# EAGLE design teensy_rfm69cw_nrf_upper (EAGLE 6.5.0)
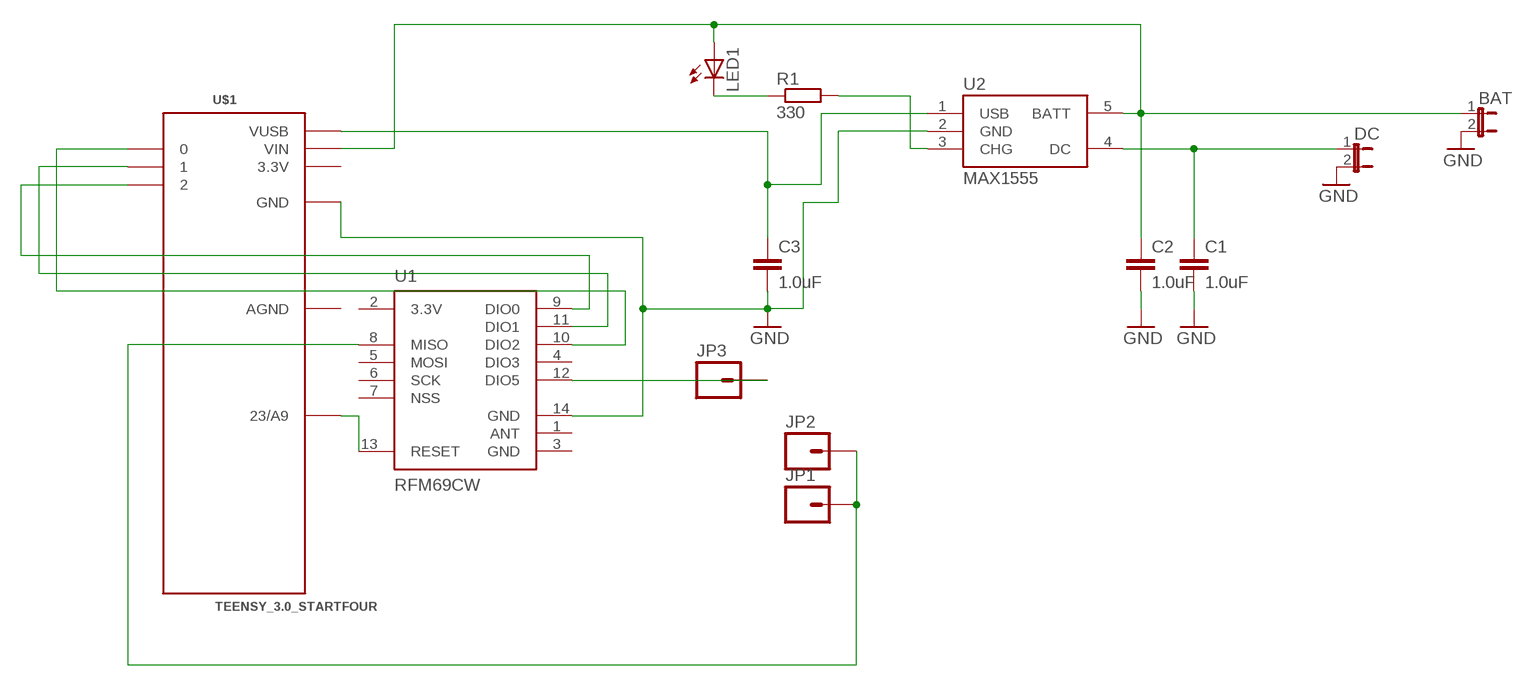
[diagram p0: schematic, sheet 1]

## Parts
BAT  JP1E  [JP1]
C1  1.0uF  1.0UF-16V-10%(0603)  [0603-CAP]
C2  1.0uF  1.0UF-16V-10%(0603)  [0603-CAP]
C3  1.0uF  1.0UF-16V-10%(0603)  [0603-CAP]
DC  JP1E  [JP1]
JP1  M01SMD-4.5X1.5  [PAD-1.5X4.5]
JP2  M01SMD-4.5X1.5  [PAD-1.5X4.5]
JP3  M01SMD-4.5X1.5  [PAD-1.5X4.5]
LED1  LEDSML0603  [SML0603]
R1  330  R-EU_R0603  [R0603]
U1  RFM69CW  [RFM69CW-XXXS2]
U2  MAX1555  [SOT23-5]
U$1  TEENSY_3.0_STARTFOUR  [TEENSY_3.0_STARTFOUR]

## Nets
GND: BAT.2 C1.2 C2.2 C3.2 DC.2 U1.14(GND) U2.2(GND) U$1.GND
N$1: LED1.C R1.1
N$2: U1.9(DIO0) U$1.2
N$3: U1.11(DIO1) U$1.1
N$4: U1.10(DIO2) U$1.0
N$5: U1.13(RESET) U$1.23/A9
N$6: C1.1 DC.1 U2.4(DC)
N$7: C3.1 U2.1(USB) U$1.VUSB
N$8: R1.2 U2.3(CHG)
N$9: JP1.P$1 JP2.P$1 U1.8(MISO)
N$10: BAT.1 C2.1 LED1.A U2.5(BATT) U$1.VIN
N$11: JP3.P$1 U1.12(DIO5)
Unconnected: U1.1(ANT) U1.4(DIO3) U1.5(MOSI) U1.6(SCK) U1.7(NSS)

## Power pins joined to a net without a drawn wire
3.3V: U1.2(3.3V) U$1.3.3V
AGND: U$1.AGND
GND: U1.3(GND)

## Library data of the parts
BAT DC = jumper:JP1E: JUMPER
C1-C3 = SparkFun-Capacitors:1.0UF-16V-10%(0603): CAP-00868; PROD_ID: CAP-00868
JP1-JP3 = mike-temp:M01: Header 1 Standard 1-pin 0.1" header. Use with straight break away headers (SKU : PRT-00116), right angle break away headers (PRT-00553), swiss pins (PRT-00743), machine pins (PRT-00117), and female headers (PRT-00115).
LED1 = led:LED: LED OSRAM: - CHIPLED LG R971, LG N971, LY N971, LG Q971, LY Q971, LO R971, LY R971 LH N974, LH R974 LS Q976, LO Q976, LY Q976 LO Q996 - Hyper CHIPLED LW Q18S LB Q993, LB Q99A, LB R99A - SideLED LS A670, LO A670, LY A670, LG A670, LP A670 LB A673, LV A673, LT A673, LW A673 LH A674 LY A675 LS A676, LA A676, LO A676, LY A676, LW A676 LS A679, LY A679, LG A679 - Hyper Micro SIDELED® LS Y876, LA Y876, LO Y876, LY Y876 LT Y87S - SmartLED LW L88C, LW L88S LB L89C, LB L89S, LG L890 LS L89K, LO L89K, LY L89K LS L896, LA L896, LO L896, LY L896 - TOPLED LS T670, LO T670, LY T670, LG T670, LP T670 LSG T670, LSP T670, LSY T670, LOP T670, LYG T670 LG T671, LOG T671, LSG T671 LB T673, LV T673, LT T673, LW T673 LH T674 LS T676, LA T676, LO T676, LY T676, LB T676, LH T676, LSB T676, LW T676 LB T67C, LV T67C, LT T67C, LS T67K, LO T67K, LY T67K, LW E67C LS E67B, LA E67B, LO E67B, LY E67B, LB E67C, LV E67C, LT E67C LW T67C LS T679, LY T679, LG T679 LS T770, LO T770, LY T770, LG T770, LP T770 LB T773, LV T773, LT T773, LW T773 LH T774 LS E675, LA E675, LY E675, LS T675 LS T776, LA T776, LO T776, LY T776, LB T776 LHGB T686 LT T68C, LB T68C - Hyper Mini TOPLED® LB M676 - Mini TOPLED Santana® LG M470 LS M47K, LO M47K, LY M47K Source: http://www.osram.convergy.de LUXEON: - LUMILED® LXK2-PW12-R00, LXK2-PW12-S00, LXK2-PW14-U00, LXK2-PW14-V00 LXK2-PM12-R00, LXK2-PM12-S00, LXK2-PM14-U00 LXK2-PE12-Q00, LXK2-PE12-R00, LXK2-PE12-S00, LXK2-PE14-T00, LXK2-PE14-U00 LXK2-PB12-K00, LXK2-PB12-L00, LXK2-PB12-M00, LXK2-PB14-N00, LXK2-PB14-P00, LXK2-PB14-Q00 LXK2-PR12-L00, LXK2-PR12-M00, LXK2-PR14-Q00, LXK2-PR14-R00 LXK2-PD12-Q00, LXK2-PD12-R00, LXK2-PD12-S00 LXK2-PH12-R00, LXK2-PH12-S00 LXK2-PL12-P00, LXK2-PL12-Q00, LXK2-PL12-R00 Source: www.luxeon.com KINGBRIGHT: KA-3528ASYC Source: www.kingbright.com
R1 = rcl:R-EU_: RESISTOR, European symbol
U1 = mike-temp:RFM69
U2 = SparkFun-PowerIC:MAX1555: MAX1555 Lithium Charger IC SOT-23 Lithium Polymer charging IC. Schematic element and footprint proven. Spark Fun Electronics SKU : COM-00674
U$1 = Teensy3.0:TEENSY_3.0_STARTFOUR

## Board
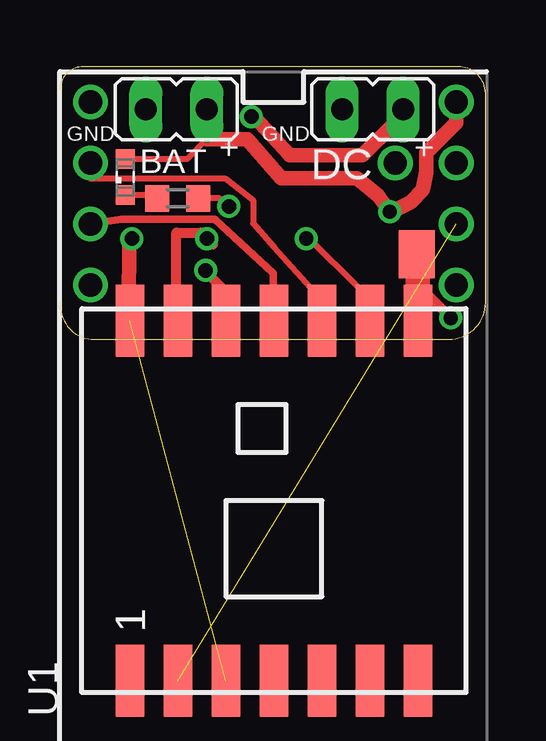
[diagram p1: board, top side]
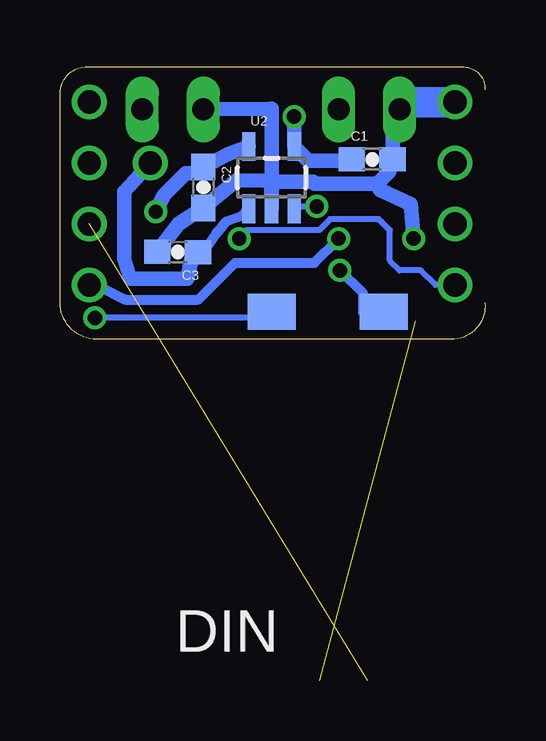
[diagram p2: board, bottom side, seen from below]

Size 17.71 x 11.34 mm. Coordinates in mm from the lower left corner, seen from the top.
Outline: 0.01,10.4 arc-90 0.87,11.34 16.67,11.34 arc-90 17.71,10.15 17.71,1.52 arc-90 16.19,0 1.28,0 arc-90 0.01,1.52
Copper layers (1*16): Top 0.0356mm / dielectric 1.5011mm / Bottom 0.0356mm
Design rules "LaenPCBOrder": minimum track width 6mil, minimum drill 13mil, track to track 6mil, track to pad 6mil, pad to pad 6mil, via to via 6mil, smd to smd 6mil, copper to edge 15mil, drill to drill 6mil, minimum pad ring 7mil, minimum via ring 7mil, stop-mask expansion 3mil, vias tented up to drill 0mil, thermal gap 10mil

### Footprints (pad centres in the part's own frame; a part is rotated, then mirrored left to right if it is on the bottom)
JP1 = drill 0.914 long: 1 0,-1.27; 2 0,1.27
0603-CAP = smd 1.1 x 1: 1 -0.85,0; 2 0.85,0
PAD-1.5X4.5 = smd 1.5 x 2: P$1 0,0
SML0603 = smd 0.8 x 0.8: A 0.75,0; C -0.75,0
R0603 = smd 1 x 1.1: 1 -0.85,0; 2 0.85,0
RFM69CW-XXXS2 = smd 3 x 1.2: 1 -7.5,6; 2 -7.5,4; 3 -7.5,2; 4 -7.5,0; 5 -7.5,-2; 6 -7.5,-4; 7 -7.5,-6; 8 7.5,-6; 9 7.5,-4; 10 7.5,-2; 11 7.5,0; 12 7.5,2; 13 7.5,4; 14 7.5,6
SOT23-5 = smd 0.55 x 1.2: 1 -0.95,-1.3; 2 0,-1.3; 3 0.95,-1.3; 4 0.95,1.3; 5 -0.95,1.3
TEENSY_3.0_STARTFOUR = drill 0.965: 0 -7.62,13.97; 1 -7.62,11.43; 2 -7.62,8.89; 3.3V 7.62,11.43; 23/A9 7.62,8.89; AGND 7.62,13.97; GND -7.62,16.51; VIN 7.62,16.51; VUSB 5.08,13.97

### Placement (x,y rotation side)
BAT  4.83,9.58 90 top
C1  4.7,7.49 0 bottom
C2  11.74,6.32 270 bottom
C3  12.81,3.63 179.7 bottom
DC  13.01,9.58 90 top
JP1  14.84,3.53 180 top
JP2  8.9,1.14 270 bottom
JP3  4.22,1.14 270 bottom
LED1  2.7,6.76 90 top
R1  4.88,5.87 0 top
U1  8.9,-6.73 90 top
U2  8.9,6.73 0 bottom
U$1  8.87,-6.63 0 top

### Tracks (layer width: path | path; a pad name or v marks a point on that pad's centre or on a via)
3.3V  (1 unrouted)
GND  (via drill 0.6 pad 0.3)  (1 unrouted)
  Top 0.61: U1.14 2.9,2.06 2.7,1.3 2.98,1.19 2.77,0.81 2.67,0.94 2.85,1.37 2.88,4.09 v2.98,4.19
  Bottom 0.61: BAT.2 3.85,9.36 C1.2 3.99,7.21 3.99,6.98 4.5,6.48 | DC.2 8.92,9.6 8.9,9.6 U2.2 8.92,6.55 | 8.92,6.55 8.92,6.6 10.34,6.63 C2.2 12.76,4.8 C3.2 | 4.5,6.48 7.09,6.48 7.17,6.55 8.62,6.55 8.92,6.55 | v2.98,4.19 3.1,5.61 4.35,6.2 4.37,6.2 4.5,6.48
  Bottom 1.27: U$1.GND 3.38,9.88 3.41,9.86 BAT.2
N$1
  Top 0.254: R1.1 3.89,6.01 LED1.C
N$2  (via drill 0.6)
  Top 0.152: v10.24,4.19 10.32,4.22 | 12.88,2.06 U1.9
  Top 0.254: 12.88,2.06 12.5,2.06 10.29,4.27 10.24,4.22 v10.24,4.19
  Bottom 0.254: v10.24,4.19 9.91,4.55 6.91,4.55 6.46,5 4.45,5 4.32,4.9 3.97,4.55 3.97,3.28 3.56,2.87 2.67,2.87 2.06,2.26 U$1.2
N$3
  Top 0.305: U$1.1 2.55,5 6.43,5 8.87,2.74 U1.11
N$4
  Top 0.254: U$1.0 1.25,6.71 6.86,6.71 8.03,5.79 8.03,4.83 8.9,3.86 10.8,1.73 10.9,1.63 U1.10
N$5  (via drill 0.6)
  Top 0.406: U1.13 4.83,2.16 4.83,4.45 5.85,4.45 v6.1,4.19 6.36,3.94
  Bottom 0.406: U$1.23/A9 16.26,2.16 16.01,2.16 14.99,1.65 11.94,1.65 10.42,3.18 7.12,3.18 v6.1,4.19
N$6  (via drill 0.6)
  Top 0.61: DC.1 14.23,8.99 13.92,8.99 12.58,7.67 9.56,7.67 8.08,9.27 v7.96,9.27
  Bottom 0.61: C1.1 5.61,7.44 7.37,7.44 7.95,8.02 U2.4 7.96,8.33 v7.96,9.27
N$7
  Bottom 0.406: U2.1 10.15,5.13 10.78,4.9 10.95,4.7 11.18,4.45 11.74,3.63 C3.1
  Bottom 0.61: U$1.VUSB 15.04,6.15 15.04,3.35 14.79,2.52 12.4,2.52 12.22,3.38 12.02,3.54 C3.1
N$8  (via drill 0.6 pad 0.3)
  Top 0.254: v7.02,5.54 6.97,5.54 6.63,5.87 R1.2
  Bottom 0.254: v7.02,5.54 7.96,5.54 U2.3
N$9  (via drill 0.6)
  Top 0.152: JP1.P$1 15.09,3.63 15.25,3.43 U1.8
  Top 0.406: v16.26,0.89 15.25,1.91 U1.8
  Top 1.016: U1.8 14.89,3.73
  Bottom 0.254: JP2.P$1 8.13,0.89 v16.26,0.89
  Bottom 0.406: v16.26,0.89 16.26,0.64
N$10  (via drill 0.6)
  Top 0.254: 6.1,8.33 5.28,7.51 LED1.A
  Top 0.61: U$1.VIN 16.49,9.02 15.25,7.77 15.25,6.96 15.09,6.22 14.59,5.71 13.8,5.31 v13.72,5.31 13.24,5.97 12.73,6.4 12.35,6.71 9.2,6.71 7.8,8.31 | 7.8,8.31 7.78,8.33 6.1,8.33 BAT.1 | 7.8,8.31 7.88,8.23
  Bottom 0.61: U2.5 10.73,7.71 C2.1 11.84,6.91 12.48,6.91 13.39,5.99 v13.72,5.31
N$11  (via drill 0.6)
  Top 0.406: U1.12 6.91,0.79 6.91,1.96 6.05,2.82 v6.05,2.87
  Bottom 0.406: v6.05,2.87 5.09,1.91 5.09,1.14 JP3.P$1

### Text on the board
tNames: GND | GND | + | +
bNames: DIN